# Altium schematic sheet Sheet4 - Capteurs.SchDoc
size A4
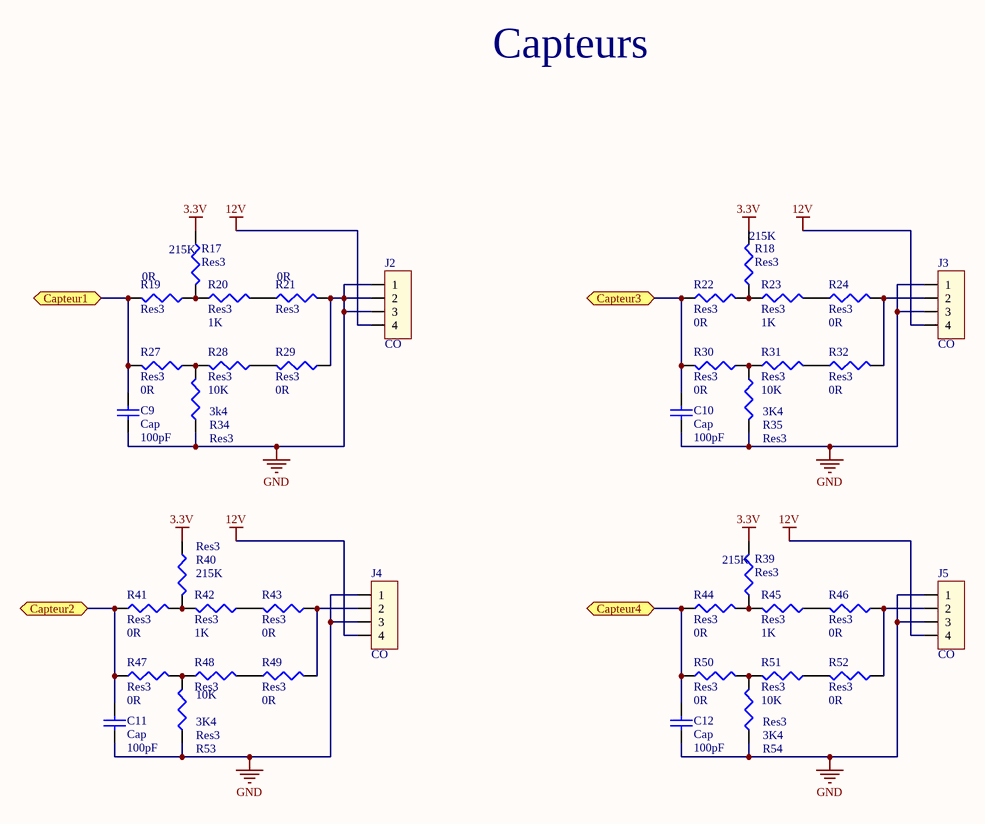
[diagram p0: Sheet4 - Capteurs.SchDoc]

## Parts
C9  Cap  value 100pF  [RAD-0.3]
C10  Cap  value 100pF  [RAD-0.3]
C11  Cap  value 100pF  [RAD-0.3]
C12  Cap  value 100pF  [RAD-0.3]
J2  CO  [MICRO-MATCH FOB.04P]
J3  CO  [MICRO-MATCH FOB.04P]
J4  CO  [MICRO-MATCH FOB.04P]
J5  CO  [MICRO-MATCH FOB.04P]
R17  Res3  value 215K  [RESC1608L]
R18  Res3  value 215K  [RESC1608L]
R19  Res3  value 0R  [RESC1608L]
R20  Res3  value 1K  [RESC1608L]
R21  Res3  value 0R  [RESC1608L]
R22  Res3  value 0R  [RESC1608L]
R23  Res3  value 1K  [RESC1608L]
R24  Res3  value 0R  [RESC1608L]
R27  Res3  value 0R  [RESC1608L]
R28  Res3  value 10K  [RESC1608L]
R29  Res3  value 0R  [RESC1608L]
R30  Res3  value 0R  [RESC1608L]
R31  Res3  value 10K  [RESC1608L]
R32  Res3  value 0R  [RESC1608L]
R34  Res3  value 3k4  [RESC1608L]
R35  Res3  value 3K4  [RESC1608L]
R39  Res3  value 215K  [RESC1608L]
R40  Res3  value 215K  [RESC1608L]
R41  Res3  value 0R  [RESC1608L]
R42  Res3  value 1K  [RESC1608L]
R43  Res3  value 0R  [RESC1608L]
R44  Res3  value 0R  [RESC1608L]
R45  Res3  value 1K  [RESC1608L]
R46  Res3  value 0R  [RESC1608L]
R47  Res3  value 0R  [RESC1608L]
R48  Res3  value 10K  [RESC1608L]
R49  Res3  value 0R  [RESC1608L]
R50  Res3  value 0R  [RESC1608L]
R51  Res3  value 10K  [RESC1608L]
R52  Res3  value 0R  [RESC1608L]
R53  Res3  value 3K4  [RESC1608L]
R54  Res3  value 3K4  [RESC1608L]

## Ports
Capteur1 (bidir), Capteur2 (bidir), Capteur3 (bidir), Capteur4 (bidir)

## Nets
3.3V: R17.1 R18.2 R39.2 R40.1
12V: J2.4 J3.4 J4.4 J5.4
GND: C9.2 C10.2 C11.2 C12.2 J2.1 J2.2 J2.3 J3.1 J3.3 J4.1 J4.3 J5.1 J5.3 R21.2 R29.1 R34.1 R35.2 R53.1 R54.1
Capteur1: C9.1 R19.2 R27.2 ; port Capteur1
Capteur2: C11.1 R41.1 R47.1 ; port Capteur2
Capteur3: C10.1 R22.1 R30.2 ; port Capteur3
Capteur4: C12.1 R44.1 R50.1 ; port Capteur4
NetJ3_2: J3.2 R24.2 R32.2
NetJ4_2: J4.2 R43.1 R49.2
NetJ5_2: J5.2 R46.1 R52.1
NetR17_2: R17.2 R19.1 R20.1
NetR18_1: R18.1 R22.2 R23.1
NetR20_2: R20.2 R21.1
NetR23_2: R23.2 R24.1
NetR27_1: R27.1 R28.2 R34.2
NetR28_1: R28.1 R29.2
NetR30_1: R30.1 R31.1 R35.1
NetR31_2: R31.2 R32.1
NetR39_1: R39.1 R44.2 R45.2
NetR40_2: R40.2 R41.2 R42.2
NetR42_1: R42.1 R43.2
NetR45_1: R45.1 R46.2
NetR47_2: R47.2 R48.1 R53.2
NetR48_2: R48.2 R49.1
NetR50_2: R50.2 R51.2 R54.2
NetR51_1: R51.1 R52.2

## Notes on the sheet
- Capteurs

## Library data of the parts
C9-C12 = Cap: Capacitor; Published: 8-Jun-2000; LatestRevisionDate: 17-Jul-2002; LatestRevisionNote: Re-released for DXP Platform.; PackageReference: RAD-0.3; Publisher: Altium Limited
J2-J5 = MICRO-MATCH FOB.04P: Connecteur
R17-R24 R27-R32 R34 R35 R39-R54 = Res3: Resistor; Published: 8-Jun-2000; LatestRevisionDate: 29-May-2009; LatestRevisionNote: IPC-7351 Footprint Added.; PackageReference: J1-0603; Publisher: Altium Limited; PackageDescription: Chip Resistor